# Altium schematic sheet FEV-60_Motor_Driver.SchDoc
size B; Revision: A0
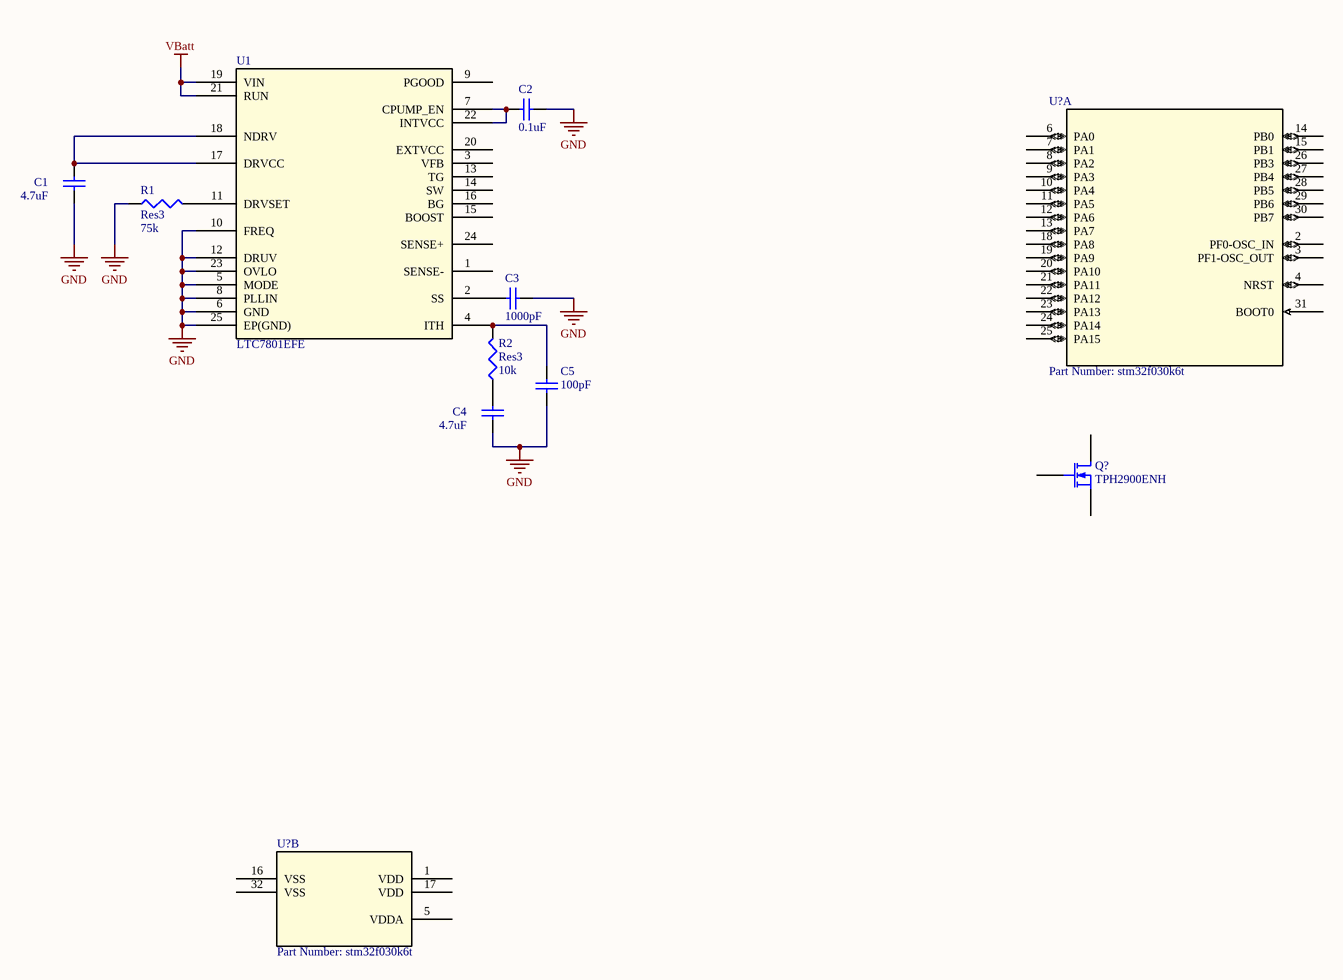
[diagram p0: FEV-60_Motor_Driver.SchDoc]

## Parts
(Parts that share a designator on the sheet are numbered #1, #2 ... from top to bottom, then left to right.)
C1  value 4.7uF  [1608[0603]]  (hidden comment: Cap Semi)
C2  value 0.1uF  [1608[0603]]  (hidden comment: Cap Semi)
C3  value 1000pF  [1608[0603]]  (hidden comment: Cap Semi)
C4  value 4.7uF  [1608[0603]]  (hidden comment: Cap Semi)
C5  value 100pF  [1608[0603]]  (hidden comment: Cap Semi)
Q?  TPH2900ENH
R1  Res3  value 75k  [J1-0603]
R2  Res3  value 10k  [J1-0603]
U1  LTC7801EFE  [LTC7801]
U?#1  Part Number: stm32f030k6t  [LQFP-32]  (part A of 2)
U?#2  Part Number: stm32f030k6t  [LQFP-32]  (part B of 2)

## Nets
GND: C1.1 C2.1 C3.1 C4.1 C5.1 R1.1 U1.5(MODE) U1.6(GND) U1.8(PLLIN) U1.10(FREQ) U1.12(DRUV) U1.23(OVLO) U1.25(EP(GND))
VBatt: U1.19(VIN) U1.21(RUN)
NetC1_2: C1.2 U1.17(DRVCC) U1.18(NDRV)
NetC2_2: C2.2 U1.7(CPUMP_EN) U1.22(INTVCC)
NetC3_2: C3.2 U1.2(SS)
NetC4_2: C4.2 R2.1
NetC5_2: C5.2 R2.2 U1.4(ITH)
NetR1_2: R1.2 U1.11(DRVSET)

Not connected (* = marked no-connect by the designer): Q? 1(D) 2(G) 3(S); U1 1(SENSE-) 3(VFB) 9(PGOOD) 13(TG) 14(SW) 15(BOOST) 16(BG) 20(EXTVCC) 24(SENSE+); U?#1 2(PF0-OSC_IN) 3(PF1-OSC_OUT) 4(NRST) 6(PA0) 7(PA1) 8(PA2) 9(PA3) 10(PA4) 11(PA5) 12(PA6) 13(PA7) 14(PB0) 15(PB1) 18(PA8) 19(PA9) 20(PA10) 21(PA11) 22(PA12) 23(PA13) 24(PA14) 25(PA15) 26(PB3) 27(PB4) 28(PB5) 29(PB6) 30(PB7) 31(BOOT0); U?#2 1(VDD) 5(VDDA) 16(VSS) 17(VDD) 32(VSS)

## Notes on the sheet
- Title
- Date:
- Revision:
- Number:
- Team Skytanic
- Sheet
- of
- Senior Design
- 2019/2020
- File:

## Library data of the parts
C1-C5 = Cap Semi: Capacitor (Semiconductor SIM Model); Published: 8-Jun-2000; LatestRevisionDate: 29-May-2009; LatestRevisionNote: IPC-7351 Footprint Added.; PackageReference: C1206; Publisher: Altium Limited; PackageDescription: Chip Capacitor
Q? = TPH2900ENH: Manufacturer: Toshiba; Part Number: TPH2900ENHL1QCT-ND; ComponentLink1Description: TPH2900ENH; ComponentLink1URL: https://www.digikey.com/product-detail/en/toshiba-semiconductor-and-storage/TPH2900ENHL1Q/TPH2900ENHL1QCT-ND/5456291
R1 R2 = Res3: Resistor; Published: 8-Jun-2000; LatestRevisionDate: 29-May-2009; LatestRevisionNote: IPC-7351 Footprint Added.; PackageReference: J1-0603; Publisher: Altium Limited; PackageDescription: Chip Resistor
U1 = LTC7801EFE: Buck Regulator Positive Output Step-Down DC-DC Controller IC 24-TSSOP; Manufacturer: Analog Devices; Part Number: LTC7801EFE#PBF; Copyright: Copyright (C) 2018 Accelerated Designs. All rights reserved; RefDes: RefDes; Type: DEV; Value: Value
U?#1 U?#2 = STM32F030K6T: No Description Available; Manufacturer: STMicroelectronics; Copyright: Copyright (C) 2016 Accelerated Designs. All rights reserved; RefDes: RefDes; Type: DEV; Value: Value